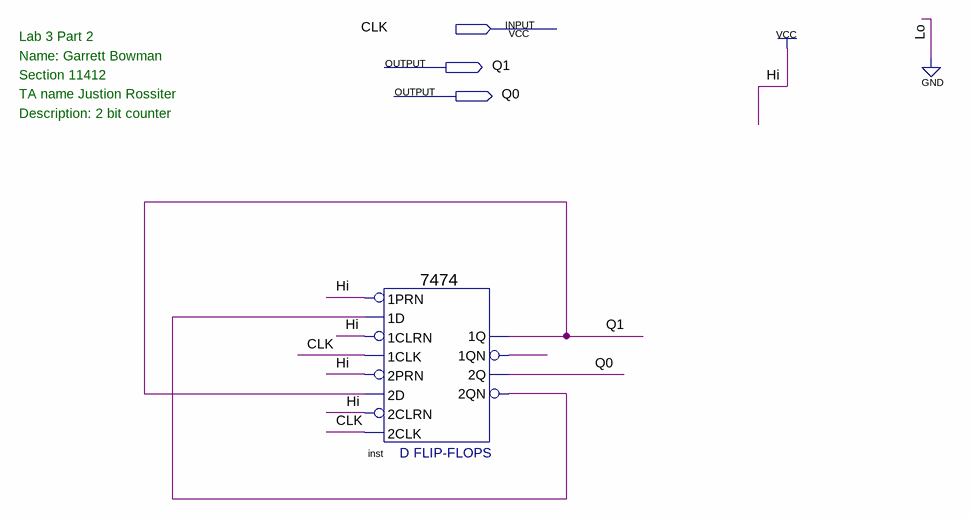
[diagram p0: schematic sheet]
// Quartus schematic Lab3_7seg.bdf as structural Verilog: 1 symbols, 3 pins
module Lab3_7seg (
  input  CLK,
  output Q1,
  output Q0
);

  wire inst_1qn, inst_2qn;

  \7474  inst (
    .\2D (Q1), .\2PRN (1'b1), .\1CLK (CLK), .\1D (inst_2qn), .\1PRN (1'b1), .\2CLK (CLK), .\2CLRN (1'b1),
    .\1CLRN (1'b1), .\1QN (inst_1qn), .\2Q (Q0), .\2QN (inst_2qn), .\1Q (Q1));

  // Notes on the sheet:
  //   Lab 3 Part 2
  //   Name: Garrett Bowman
  //   Section 11412
  //   TA name Justion Rossiter
  //   Description: 2 bit counter
endmodule
